# Altium schematic sheet Bridge Regulator.SchDoc: Full Bridge Regulator
size A4; ApprovedBy: LD Stanton; CheckedBy: None; Author: LD Stanton; CompanyName: University of Cape Town; DrawnBy: Lawrence Stanton; Engineer: Lawrence Stanton; Organization: University of Cape Town; Address1: Department of Electrical Engineering; Address2: Rondebosch; Address3: Cape Town; Address4: South Africa 7701; DocumentNumber: 6; SheetNumber: 6; SheetTotal: 20; Approv_Date_Eng: --/--/----; Approv_Date_Chk: --/--/----; PCB_Doc: TBD; ASM_Doc: TBD; FAB_Doc: TBD; CML_Doc: TBD; BOM_Doc: TBD
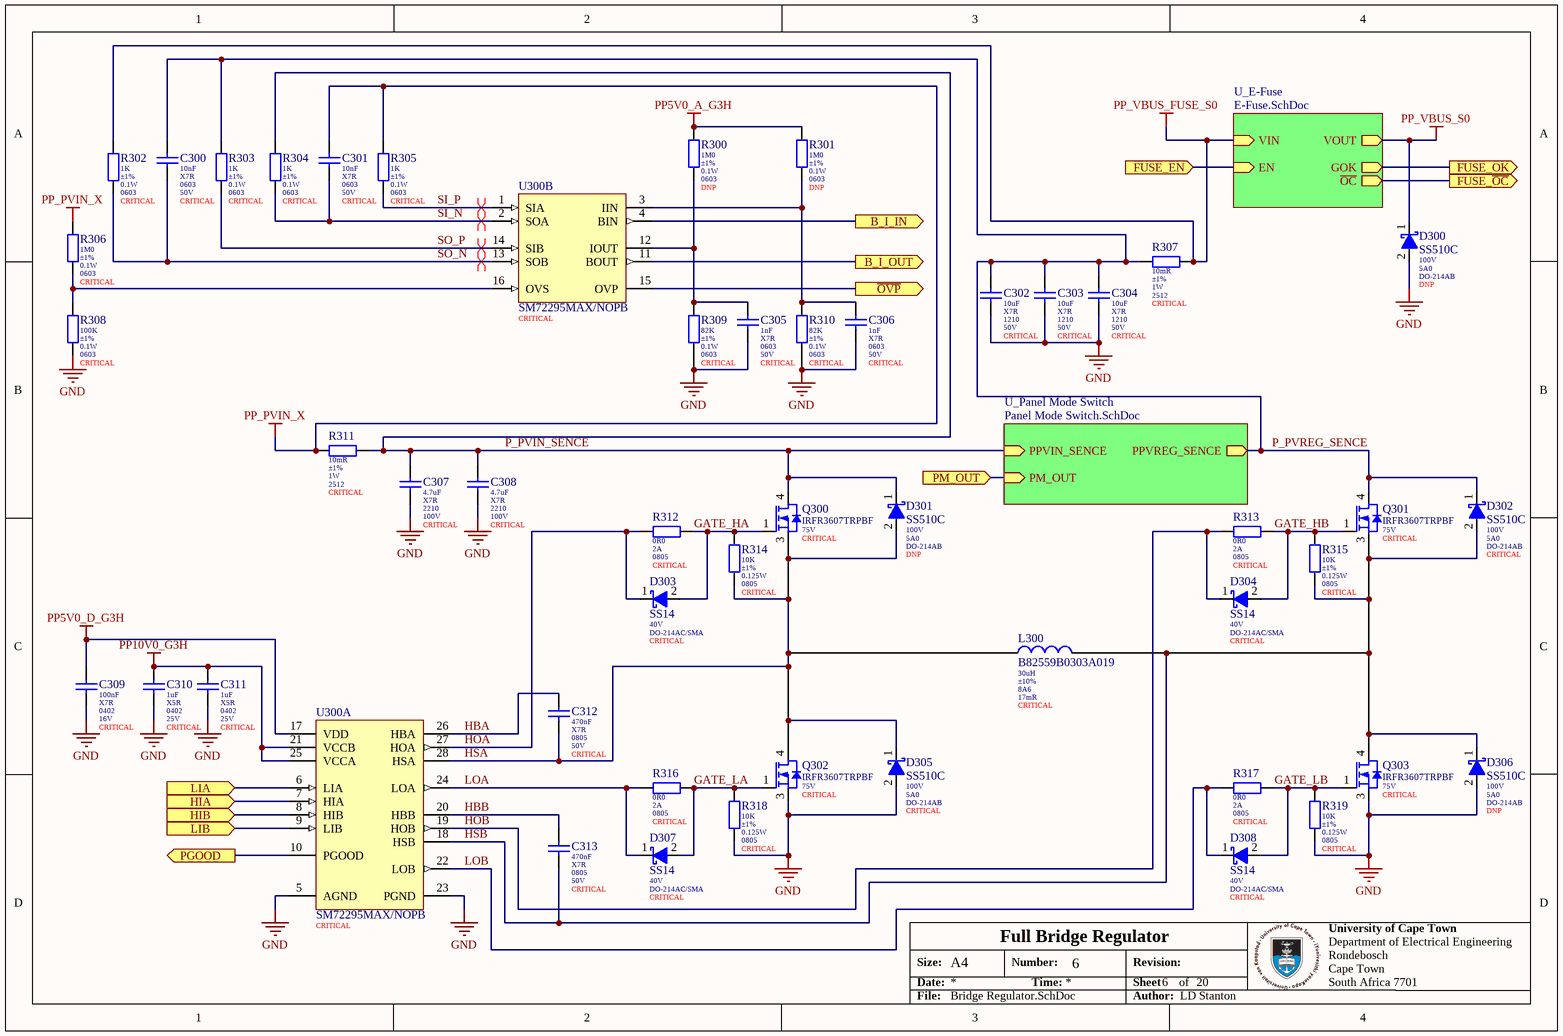
[diagram p0: Bridge Regulator.SchDoc]

## Parts
C300  value 10nF  Dielectric: X7R  Package: 0603  Voltage: 50V  Populate: CRITICAL  [0603_080 (Guandong) B]  (hidden comment: 0603B103K500NT)
C301  value 10nF  Dielectric: X7R  Package: 0603  Voltage: 50V  Populate: CRITICAL  [0603_080 (Guandong) B]  (hidden comment: 0603B103K500NT)
C302  value 10uF  Dielectric: X7R  Package: 1210  Voltage: 50V  Populate: CRITICAL  [1212_250_J (Samsumg) B]  (hidden comment: CL32B106KBJNFNE)
C303  value 10uF  Dielectric: X7R  Package: 1210  Voltage: 50V  Populate: CRITICAL  [1212_250_J (Samsumg) B]  (hidden comment: CL32B106KBJNFNE)
C304  value 10uF  Dielectric: X7R  Package: 1210  Voltage: 50V  Populate: CRITICAL  [1212_250_J (Samsumg) B]  (hidden comment: CL32B106KBJNFNE)
C305  value 1nF  Dielectric: X7R  Package: 0603  Voltage: 50V  Populate: CRITICAL  [0603_080_8 (Samsung) B]  (hidden comment: CL10B102KB8NNNC)
C306  value 1nF  Dielectric: X7R  Package: 0603  Voltage: 50V  Populate: CRITICAL  [0603_080_8 (Samsung) B]  (hidden comment: CL10B102KB8NNNC)
C307  value 4.7uF  Dielectric: X7R  Package: 2210  Voltage: 100V  Populate: CRITICAL  [2220_F (PSA) B]  (hidden comment: FS55X475K101EGG)
C308  value 4.7uF  Dielectric: X7R  Package: 2210  Voltage: 100V  Populate: CRITICAL  [2220_F (PSA) B]  (hidden comment: FS55X475K101EGG)
C309  value 100nF  Dielectric: X7R  Package: 0402  Voltage: 16V  Populate: CRITICAL  [0402_050_5 (Samsumg) B]  (hidden comment: CL05B104KO5NNNC)
C310  value 1uF  Dielectric: X5R  Package: 0402  Voltage: 25V  Populate: CRITICAL  [0402_050_5 (Samsumg) B]  (hidden comment: CL05A105KA5NQNC)
C311  value 1uF  Dielectric: X5R  Package: 0402  Voltage: 25V  Populate: CRITICAL  [0402_050_5 (Samsumg) B]  (hidden comment: CL05A105KA5NQNC)
C312  value 470nF  Dielectric: X7R  Package: 0805  Voltage: 50V  Populate: CRITICAL  [0805_125_F (Samsumg) B]  (hidden comment: CL21B474KBFNNNE)
C313  value 470nF  Dielectric: X7R  Package: 0805  Voltage: 50V  Populate: CRITICAL  [0805_125_F (Samsumg) B]  (hidden comment: CL21B474KBFNNNE)
D300  SS510C  Blocking Voltage: 100V  Forward Current: 5A0  Package: DO-214AB  Placement: DNP  [DO-214AB/SMC (MDD) B]
D301  SS510C  Blocking Voltage: 100V  Forward Current: 5A0  Package: DO-214AB  Placement: DNP  [DO-214AB/SMC (MDD) B]
D302  SS510C  Blocking Voltage: 100V  Forward Current: 5A0  Package: DO-214AB  Placement: CRITICAL  [DO-214AB/SMC (MDD) B]
D303  SS14  Blocking Voltage: 40V  Package: DO-214AC/SMA  Placement: CRITICAL  [DO-214AC (MDD) B]
D304  SS14  Blocking Voltage: 40V  Package: DO-214AC/SMA  Placement: CRITICAL  [DO-214AC (MDD) B]
D305  SS510C  Blocking Voltage: 100V  Forward Current: 5A0  Package: DO-214AB  Placement: CRITICAL  [DO-214AB/SMC (MDD) B]
D306  SS510C  Blocking Voltage: 100V  Forward Current: 5A0  Package: DO-214AB  Placement: DNP  [DO-214AB/SMC (MDD) B]
D307  SS14  Blocking Voltage: 40V  Package: DO-214AC/SMA  Placement: CRITICAL  [DO-214AC (MDD) B]
D308  SS14  Blocking Voltage: 40V  Package: DO-214AC/SMA  Placement: CRITICAL  [DO-214AC (MDD) B]
L300  B82559B0303A019  value 30uH  Tolerance: ±10%  Rated Current: 8A6  DC Resistance: 17mR  Placement: CRITICAL  [B82559B0303A019-Footprint-1]
Q300  IRFR3607TRPBF  Maximum Drain Source Voltage: 75V  Placement: CRITICAL  [TO-252A (IRFR3607) B]
Q301  IRFR3607TRPBF  Maximum Drain Source Voltage: 75V  Placement: CRITICAL  [TO-252A (IRFR3607) B]
Q302  IRFR3607TRPBF  Maximum Drain Source Voltage: 75V  Placement: CRITICAL  [TO-252A (IRFR3607) B]
Q303  IRFR3607TRPBF  Maximum Drain Source Voltage: 75V  Placement: CRITICAL  [TO-252A (IRFR3607) B]
R300  value 1M0  Tolerance: ±1%  Power: 0.1W  Package: 0603  Populate: DNP  [0603 (Uniroyal) B]  (hidden comment: 0603WAF1004T5E)
R301  value 1M0  Tolerance: ±1%  Power: 0.1W  Package: 0603  Populate: DNP  [0603 (Uniroyal) B]  (hidden comment: 0603WAF1004T5E)
R302  value 1K  Tolerance: ±1%  Power: 0.1W  Package: 0603  Populate: CRITICAL  [0603 (Uniroyal) B]  (hidden comment: 0603WAF1001T5E)
R303  value 1K  Tolerance: ±1%  Power: 0.1W  Package: 0603  Populate: CRITICAL  [0603 (Uniroyal) B]  (hidden comment: 0603WAF1001T5E)
R304  value 1K  Tolerance: ±1%  Power: 0.1W  Package: 0603  Populate: CRITICAL  [0603 (Uniroyal) B]  (hidden comment: 0603WAF1001T5E)
R305  value 1K  Tolerance: ±1%  Power: 0.1W  Package: 0603  Populate: CRITICAL  [0603 (Uniroyal) B]  (hidden comment: 0603WAF1001T5E)
R306  value 1M0  Tolerance: ±1%  Power: 0.1W  Package: 0603  Populate: CRITICAL  [0603 (Uniroyal) B]  (hidden comment: 0603WAF1004T5E)
R307  value 10mR  Tolerance: ±1%  Power: 1W  Package: 2512  Populate: CRITICAL  [2512 (Uniroyal) B]  (hidden comment: 25121WF100MT4E)
R308  value 100K  Tolerance: ±1%  Power: 0.1W  Package: 0603  Populate: CRITICAL  [0603 (Uniroyal) B]  (hidden comment: 0603WAF1003T5E)
R309  value 82K  Tolerance: ±1%  Power: 0.1W  Package: 0603  Populate: CRITICAL  [0603 (Uniroyal) B]  (hidden comment: 0603WAF8202T5E)
R310  value 82K  Tolerance: ±1%  Power: 0.1W  Package: 0603  Populate: CRITICAL  [0603 (Uniroyal) B]  (hidden comment: 0603WAF8202T5E)
R311  value 10mR  Tolerance: ±1%  Power: 1W  Package: 2512  Populate: CRITICAL  [2512 (Uniroyal) B]  (hidden comment: 25121WF100MT4E)
R312  value 0R0  Current: 2A  Package: 0805  Populate: CRITICAL  [0805 (Uniroyal) B]  (hidden comment: 0805W8F0000T5E)
R313  value 0R0  Current: 2A  Package: 0805  Populate: CRITICAL  [0805 (Uniroyal) B]  (hidden comment: 0805W8F0000T5E)
R314  value 10K  Tolerance: ±1%  Power: 0.125W  Package: 0805  Populate: CRITICAL  [0805 (Uniroyal) B]  (hidden comment: 0805W8F1002T5E)
R315  value 10K  Tolerance: ±1%  Power: 0.125W  Package: 0805  Populate: CRITICAL  [0805 (Uniroyal) B]  (hidden comment: 0805W8F1002T5E)
R316  value 0R0  Current: 2A  Package: 0805  Populate: CRITICAL  [0805 (Uniroyal) B]  (hidden comment: 0805W8F0000T5E)
R317  value 0R0  Current: 2A  Package: 0805  Populate: CRITICAL  [0805 (Uniroyal) B]  (hidden comment: 0805W8F0000T5E)
R318  value 10K  Tolerance: ±1%  Power: 0.125W  Package: 0805  Populate: CRITICAL  [0805 (Uniroyal) B]  (hidden comment: 0805W8F1002T5E)
R319  value 10K  Tolerance: ±1%  Power: 0.125W  Package: 0805  Populate: CRITICAL  [0805 (Uniroyal) B]  (hidden comment: 0805W8F1002T5E)
U300  SM72295MAX/NOPB  Placement: CRITICAL  [DW0028A_N]  (parts A,B of 2)

## Sub-sheets
U_E-Fuse = E-Fuse.SchDoc: VIN (in), VOUT (out), EN (in), GOK (out), ~{OC} (out)
U_Panel Mode Switch = Panel Mode Switch.SchDoc: PM_OUT (in), PPVIN_SENCE (in), PPVREG_SENCE (out)

## Ports
B_I_IN (out), B_I_OUT (out), FUSE_EN (in), FUSE_OK (out), FUSE_~{OC} (out), HIA (in), HIB (in), LIA (in), LIB (in), PGOOD (out), PM_OUT (in), ~{OVP} (out)

## Nets
GND: C302.2 C303.2 C304.2 C305.2 C306.2 C307.2 C308.2 C309.2 C310.2 C311.2 D300.2(A) D305.2(A) D306.2(A) Q302.3(S) Q303.3(S) R308.2 R309.2 R310.2 R318.2 R319.2 U300.5(AGND) U300.23(PGND)
PP5V0_A_G3H: R300.1 R301.1
PP5V0_D_G3H: C309.1 U300.17(VDD)
PP10V0_G3H: C310.1 C311.1 U300.21(VCCB) U300.25(VCCA)
PP_PVIN_X: C301.1 R305.1 R306.1 R311.1
PP_VBUS_FUSE_S0: R302.1 R307.2 ; sheet U_E-Fuse/VIN
PP_VBUS_S0: D300.1(K) ; sheet U_E-Fuse/VOUT
~{OVP}: U300.15(OVP) ; port ~{OVP}
B_I_IN: U300.4(BIN) ; port B_I_IN
B_I_OUT: U300.11(BOUT) ; port B_I_OUT
FUSE_EN: port FUSE_EN, sheet U_E-Fuse/EN
FUSE_~{OC}: port FUSE_~{OC}, sheet U_E-Fuse/~{OC}
FUSE_OK: port FUSE_OK, sheet U_E-Fuse/GOK
GATE_HA: D303.2(A) Q300.1(G) R312.2 R314.1
GATE_HB: D304.2(A) Q301.1(G) R313.2 R315.1
GATE_LA: D307.2(A) Q302.1(G) R316.2 R318.1
GATE_LB: D308.2(A) Q303.1(G) R317.2 R319.1
HBA: C312.1 U300.26(HBA)
HBB: C313.1 U300.20(HBB)
HIA: U300.7(HIA) ; port HIA
HIB: U300.8(HIB) ; port HIB
HOA: D303.1(K) R312.1 U300.27(HOA)
HOB: D304.1(K) R313.1 U300.19(HOB)
HSA: C312.2 D301.2(A) D305.1(K) L300.1 Q300.3(S) Q302.4(D) R314.2 U300.28(HSA)
HSB: C313.2 D302.2(A) D306.1(K) L300.2 Q301.3(S) Q303.4(D) R315.2 U300.18(HSB)
LIA: U300.6(LIA) ; port LIA
LIB: U300.9(LIB) ; port LIB
LOA: D307.1(K) R316.1 U300.24(LOA)
LOB: D308.1(K) R317.1 U300.22(LOB)
P_PVIN_SENCE: C307.1 C308.1 D301.1(K) Q300.4(D) R304.1 R311.2 ; sheet U_Panel Mode Switch/PPVIN_SENCE
P_PVREG_SENCE: C300.1 C302.1 C303.1 C304.1 D302.1(K) Q301.4(D) R303.1 R307.1 ; sheet U_Panel Mode Switch/PPVREG_SENCE
PGOOD: U300.10(PGOOD) ; port PGOOD
PM_OUT: port PM_OUT, sheet U_Panel Mode Switch/PM_OUT
SI_N: C301.2 R304.2 U300.2(SOA)
SI_P: R305.2 U300.1(SIA)
SO_N: C300.2 R302.2 U300.13(SOB)
SO_P: R303.2 U300.14(SIB)
NetC305_1: C305.1 R300.2 R309.1 U300.12(IOUT)
NetC306_1: C306.1 R301.2 R310.1 U300.3(IIN)
NetR306_2: R306.2 R308.1 U300.16(OVS)

## Layout directives
differential pair: SI_N, SI_P, SO_N, SO_P

## Notes on the sheet
- Size:
- Date:
- A4
- Number:
- Time:
- Revision:
- Sheet
- of
- File:
- Author:

## Library data of the parts
C300 C301 = CMP-014-000000-11: MLCC 10nF 0603 50V X7R ±10%; Manufacturer: Guandong; Tolerance: ±15%; ComponentLink1Description: Datasheet; LCSC Part Number: C57112; ComponentLink1URL: https://datasheet.lcsc.com/szlcsc/Guangdong-Fenghua-Advanced-Tech-0402B102K500NT_C1523.pdf
C302-C304 = CMP-014-000017-1: MLCC 10uF 1210 50V X7R ±10%; Manufacturer: Samsung; LCSC Part Number: C18739; ComponentLink1URL: https://datasheet.lcsc.com/szlcsc/Samsung-Electro-Mechanics-CL05C100JB5NNNC_C32949.pdf; Tolerance: ±10%; ComponentLink1Description: Datasheet
C305 C306 = CMP-045-000000-8: MLCC 1nF 0603 50V X7R ±10%; Manufacturer: Samsung; Tolerance: ±10%; ComponentLink1URL: https://datasheet.lcsc.com/szlcsc/Samsung-Electro-Mechanics-CL05C100JB5NNNC_C32949.pdf; LCSC Part Number: C1588; ComponentLink1Description: Datasheet
C307 C308 = CMP-014-000011-1: MLCC 4.7uF 2220 100V X7R ±10%; Manufacturer: Prosperity Dielectrics; Tolerance: ±10%; ComponentLink1URL: https://datasheet.lcsc.com/lcsc/1811111621_PSA-Prosperity-Dielectrics-FS55X475K101EGG_C153031.pdf; ComponentLink1Description: Datasheet; LCSC Part Number: C153031
C309 = CMP-045-000014-12: MLCC 100nF 0402 16V X7R ±10%; Manufacturer: Samsung; Tolerance: ±10%; ComponentLink1Description: Datasheet; ComponentLink1URL: https://datasheet.lcsc.com/szlcsc/Samsung-Electro-Mechanics-CL05C100JB5NNNC_C32949.pdf; LCSC Part Number: C1525
C310 C311 = CMP-045-000001-7: MLCC 1uF 0402 25V X5R ±10%; Manufacturer: Samsung; ComponentLink1Description: Datasheet; ComponentLink1URL: https://datasheet.lcsc.com/szlcsc/Samsung-Electro-Mechanics-CL05C100JB5NNNC_C32949.pdf; Tolerance: ±10%; LCSC Part Number: C52923
C312 C313 = CMP-014-000014-1: MLCC 470nF 0805 50V X7R ±10%; Manufacturer: Samsung; LCSC Part Number: C13967; Tolerance: ±10%; ComponentLink1Description: Datasheet; ComponentLink1URL: https://datasheet.lcsc.com/szlcsc/Samsung-Electro-Mechanics-CL05C100JB5NNNC_C32949.pdf
D300 D301 D306 = CMP-022-000008-5: Schottky Barrier Diode 100V 5A 850mV SMC MDD; LCSC Part Number: C19229; ComponentLink1Description: Datasheet; ComponentLink1URL: https://datasheet.lcsc.com/lcsc/2012031610_MDD（Microdiode-Electronics）-SS510C_C19229.pdf
D302 D305 = CMP-022-000008-6: Schottky Barrier Diode 100V 5A 850mV SMC MDD; LCSC Part Number: C19229; ComponentLink1Description: Datasheet; ComponentLink1URL: https://datasheet.lcsc.com/lcsc/2012031610_MDD（Microdiode-Electronics）-SS510C_C19229.pdf; Manufacturer: MDD
D303 D304 D307 D308 = CMP-022-000000-2: Schottky Barrier Diode 40V 1A; ComponentLink1URL: https://datasheet.lcsc.com/szlcsc/1903051003_MDD-Jiangsu-Yutai-Elec-SS14_C2480.pdf; LCSC Part Number: C2480; Forward Curent: 1A; ComponentLink1Description: Datasheet
L300 = CMP-000028-5: Helically Would High Current Inductor. 30uH, 8.6A, 17mOhm; Manufacturor: TDK; Core: Ferrite; Saturation Current: 11A5; ComponentLink1Description: Datasheet; ComponentLink1URL: https://media.digikey.com/pdf/Data%20Sheets/TDK%20PDFs/B82559BxA019_Series_DS.pdf
Q300-Q303 = CMP-013-00000-2: Single N-Channel 75V 9mR 84nC Power MOSFET TO-252; Input Capacitance: 3.07nF; Max Power Dissipation: 140W; Continuous Drain Current: 56A; ComponentLink1Description: Datasheet; ComponentLink1URL: https://datasheet.lcsc.com/lcsc/1810121140_Infineon-Technologies-IRFR3607TRPBF_C74775.pdf; LCSC Part Number: C74775; Max Operating Temperature: 175°C; Drain Source Resistance: 9mR; Case/Package: TO-252; Min Operating Temperature: -55°C
R300 R301 = CMP-010-000313-11: Resistor 1M0 0603 ±1% Thick Film Uniroyal; Working Voltage: 50V; Temperature Coefficient: ±100ppm/K; Manufacturer: Uniroyal; Pin Count: 2; LCSC Part Number: C22935; Temperature: -55 - 155°C; ComponentLink1Description: Datasheet; ComponentLink1URL: https://datasheet.lcsc.com/szlcsc/1811062009_UNI-ROYAL-Uniroyal-Elec-0603WAF1002T5E_C25804.pdf
R302-R305 = CMP-010-000308-11: Resistor 1K0 0603 ±1% Thick Film Uniroyal; Working Voltage: 75V; Temperature Coefficient: ±100ppm/K; ComponentLink1URL: https://datasheet.lcsc.com/szlcsc/1811062009_UNI-ROYAL-Uniroyal-Elec-0603WAF1002T5E_C25804.pdf; LCSC Part Number: C21190; Pin Count: 2; Manufacturer: Uniroyal; ComponentLink1Description: Datasheet; Temperature: -55 - 155°C
R306 = CMP-010-000313-12: Resistor 1M0 0603 ±1% Thick Film Uniroyal; Working Voltage: 75V; Temperature Coefficient: ±100ppm/K; Manufacturer: Uniroyal; Pin Count: 2; LCSC Part Number: C22935; Temperature: -55 - 155°C; ComponentLink1Description: Datasheet; ComponentLink1URL: https://datasheet.lcsc.com/szlcsc/1811062009_UNI-ROYAL-Uniroyal-Elec-0603WAF1002T5E_C25804.pdf
R307 R311 = CMP-010-000388-1: Resistor 10mR 2512 ±1% Thick Film Current Sense Uniroyal; Temperature Coefficient: ±800ppm/K; Working Voltage: 200V; LCSC Part Number: C127692; ComponentLink1Description: Datasheet; Manufacturer: Uniroyal; Pin Count: 2; ComponentLink1URL: https://datasheet.lcsc.com/lcsc/1810301111_UNI-ROYAL-Uniroyal-Elec-25121WF100MT4E_C127692.pdf; Temperature: -55 - 155°C
R308 = CMP-010-000288-10: Resistor 100K 0603 ±1% Thick Film Uniroyal; Working Voltage: 75V; Temperature Coefficient: ±100ppm/K; Manufacturer: Uniroyal; ComponentLink1URL: https://datasheet.lcsc.com/szlcsc/1811062009_UNI-ROYAL-Uniroyal-Elec-0603WAF1002T5E_C25804.pdf; LCSC Part Number: C25803; Temperature: -55 - 155°C; ComponentLink1Description: Datasheet; Pin Count: 2
R309 R310 = CMP-010-000347-9: Resistor 82K 0603 ±1% Thick Film Uniroyal; Temperature Coefficient: ±100ppm/K; Working Voltage: 75V; ComponentLink1Description: Datasheet; LCSC Part Number: C23254; Temperature: -55 - 155°C; ComponentLink1URL: https://datasheet.lcsc.com/szlcsc/1811062009_UNI-ROYAL-Uniroyal-Elec-0603WAF1002T5E_C25804.pdf; Pin Count: 2; Manufacturer: Uniroyal
R312 R313 R316 R317 = CMP-010-000281-12: Jumper 0805 2A Uniroyal; LCSC Part Number: C17477; Manufacturer: Uniroyal; Temperature: -55 - 155°C; ComponentLink1URL: https://datasheet.lcsc.com/szlcsc/1811062009_UNI-ROYAL-Uniroyal-Elec-0603WAF1002T5E_C25804.pdf; Pin Count: 2; ComponentLink1Description: Datasheet
R314 R315 R318 R319 = CMP-010-000400-1: Resistor 10K 0805 ±1% Thick Film Uniroyal; Working Voltage: 150V; Temperature Coefficient: ±100ppm/K; Pin Count: 2; Temperature: -55 - 155°C; Manufacturer: Uniroyal; LCSC Part Number: C17414; ComponentLink1Description: Datasheet; ComponentLink1URL: https://datasheet.lcsc.com/szlcsc/1811062009_UNI-ROYAL-Uniroyal-Elec-0603WAF1002T5E_C25804.pdf
U300 = CMP-000000-7: Photovoltaic Full BridgeDriver 3A Non-Inv 28-Pin SOIC W T/R; ComponentLink1URL: https://www.ti.com/lit/ds/symlink/sm72295.pdf?HQS=dis-dk-null-digikeymode-dsf-pf-null-wwe&ts=1623830847089; ComponentLink1Description: Datasheet